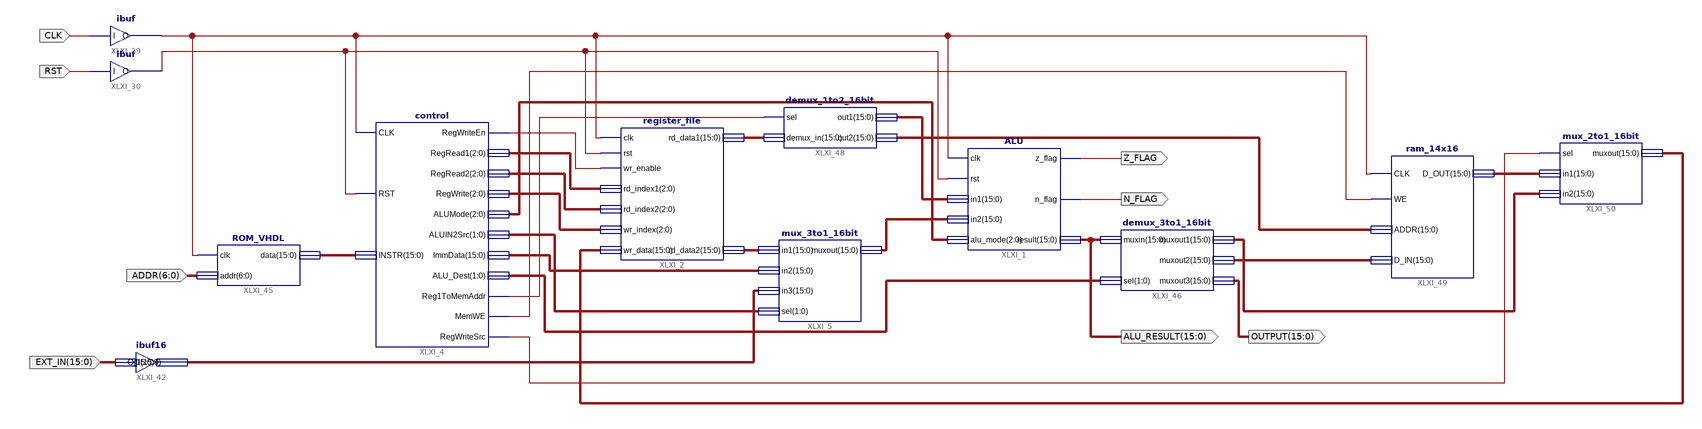
[diagram p0: schematic sheet 1]
// Xilinx ISE schematic cpu.sch (spartan3e) as structural Verilog: 12 symbols, 8 ports
module cpu (
  input  [6:0] ADDR,
  input  CLK,
  input  RST,
  input  [15:0] EXT_IN,
  output Z_FLAG,
  output N_FLAG,
  output [15:0] OUTPUT,
  output [15:0] ALU_RESULT
);

  wire XLXN_8, XLXN_316, XLXN_340, XLXN_349, XLXN_362, XLXN_372;
  wire [1:0] XLXN_104, XLXN_264;
  wire [2:0] XLXN_23, XLXN_24, XLXN_48, XLXN_49;
  wire [15:0] XLXN_13, XLXN_97, XLXN_103, XLXN_206, XLXN_207, XLXN_341, XLXN_342, XLXN_347, XLXN_348,
       XLXN_367, XLXN_368, XLXN_382;

  control XLXI_4 (
    .CLK(XLXN_316), .RST(XLXN_340), .INSTR(XLXN_206), .RegWriteEn(XLXN_8), .Reg1ToMemAddr(XLXN_349),
    .MemWE(XLXN_362), .RegRead1(XLXN_23), .RegRead2(XLXN_24), .RegWrite(XLXN_48), .ALUMode(XLXN_49),
    .ImmData(XLXN_13), .ALUIN2Src(XLXN_104), .ALU_Dest(XLXN_264), .RegWriteSrc(XLXN_372));
  register_file XLXI_2 (
    .wr_enable(XLXN_8), .rd_index1(XLXN_23), .rd_index2(XLXN_24), .wr_index(XLXN_48), .wr_data(XLXN_382),
    .rd_data2(XLXN_97), .rst(XLXN_340), .clk(XLXN_316), .rd_data1(XLXN_341));
  mux_3to1_16bit XLXI_5 (.in1(XLXN_97), .in2(XLXN_13), .in3(XLXN_207), .sel(XLXN_104), .muxout(XLXN_103));
  demux_1to2_16bit XLXI_48 (.sel(XLXN_349), .demux_in(XLXN_341), .out1(XLXN_342), .out2(XLXN_348));
  ALU XLXI_1 (
    .clk(XLXN_316), .rst(XLXN_340), .in1(XLXN_342), .in2(XLXN_103), .alu_mode(XLXN_49), .z_flag(Z_FLAG),
    .n_flag(N_FLAG), .result(ALU_RESULT));
  demux_3to1_16bit XLXI_46 (
    .muxin(ALU_RESULT), .sel(XLXN_264), .muxout1(XLXN_368), .muxout2(XLXN_347), .muxout3(OUTPUT));
  ram_14x16 XLXI_49 (.CLK(XLXN_316), .WE(XLXN_362), .ADDR(XLXN_348), .D_OUT(XLXN_367), .D_IN(XLXN_347));
  mux_2to1_16bit XLXI_50 (.sel(XLXN_372), .in1(XLXN_367), .in2(XLXN_368), .muxout(XLXN_382));
  ROM_VHDL XLXI_45 (.clk(XLXN_316), .addr(ADDR), .data(XLXN_206));
  ibuf XLXI_29 (.I(CLK), .O(XLXN_316));
  ibuf XLXI_30 (.I(RST), .O(XLXN_340));
  ibuf16 XLXI_42 (.I(EXT_IN), .O(XLXN_207));
endmodule
